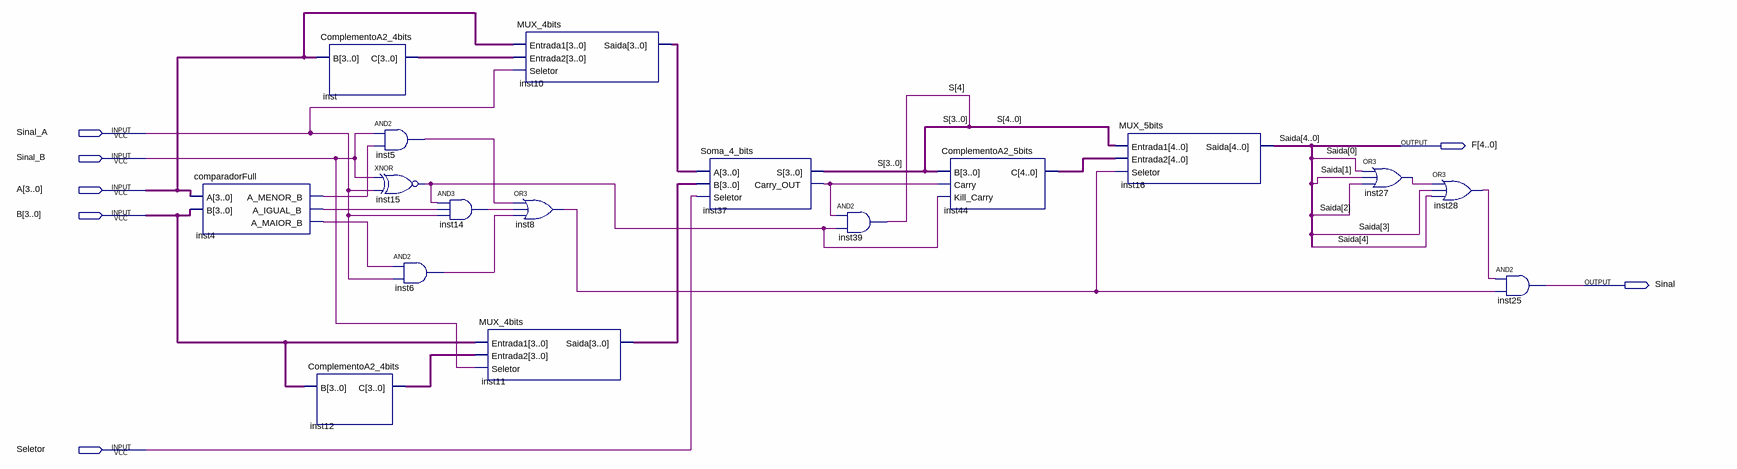
[diagram p0: schematic sheet]
// Quartus schematic Somador_Supremo.bdf as structural Verilog: 17 symbols, 7 pins
module Somador_Supremo (
  input  Sinal_A,
  input  Sinal_B,
  input  [3:0] A,
  input  [3:0] B,
  input  Seletor,
  output [4:0] F,
  output Sinal
);

  wire inst4_a_igual_b, inst4_a_maior_b, inst4_a_menor_b, inst5_out, inst6_out, inst8_out, inst14_out,
       inst15_out, inst27_out, inst28_out, inst37_carry_out;
  wire [3:0] inst10_saida, inst11_saida, inst12_c, inst_c;
  wire [4:0] inst44_c, S;

  comparadorFull inst4 (
    .A(A), .B(B), .A_MENOR_B(inst4_a_menor_b), .A_IGUAL_B(inst4_a_igual_b), .A_MAIOR_B(inst4_a_maior_b));
  ComplementoA2_4bits inst (.B(A), .C(inst_c));
  ComplementoA2_4bits inst12 (.B(B), .C(inst12_c));
  and inst5 (inst5_out, Sinal_B, inst4_a_menor_b);
  xnor inst15 (inst15_out, Sinal_B, Sinal_A);
  and inst6 (inst6_out, inst4_a_maior_b, Sinal_A);
  and inst14 (inst14_out, inst15_out, inst4_a_igual_b, Sinal_A);
  MUX_4bits inst11 (.Entrada1(B), .Entrada2(inst12_c), .Seletor(Sinal_B), .Saida(inst11_saida));
  MUX_4bits inst10 (.Entrada1(A), .Entrada2(inst_c), .Seletor(Sinal_A), .Saida(inst10_saida));
  or inst8 (inst8_out, inst5_out, inst14_out, inst6_out);
  Soma_4_bits inst37 (.A(inst10_saida), .B(inst11_saida), .Seletor(Seletor), .S(S[3:0]), .Carry_OUT(inst37_carry_out));
  and inst39 (S[4], inst37_carry_out, inst15_out);
  ComplementoA2_5bits inst44 (.B(S[3:0]), .Carry(inst37_carry_out), .Kill_Carry(inst15_out), .C(inst44_c));
  MUX_5bits inst16 (.Entrada1(S), .Entrada2(inst44_c), .Seletor(inst8_out), .Saida(F));
  or inst27 (inst27_out, F[0], F[1], F[2]);
  or inst28 (inst28_out, inst27_out, F[3], F[4]);
  and inst25 (Sinal, inst28_out, inst8_out);

  // Other names for the same wires on the sheet: Saida[4:0] = F
endmodule
